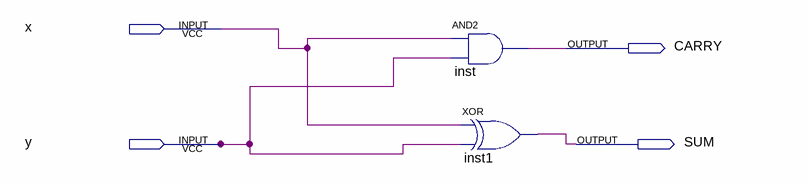
[diagram p0: schematic sheet]
// Quartus schematic add.bdf as structural Verilog: 2 symbols, 4 pins
module add (
  input  x,
  input  y,
  output CARRY,
  output SUM
);

  and inst (CARRY, x, y);
  xor inst1 (SUM, x, y);
endmodule
